# EAGLE design v2 (EAGLE 9.2.0)
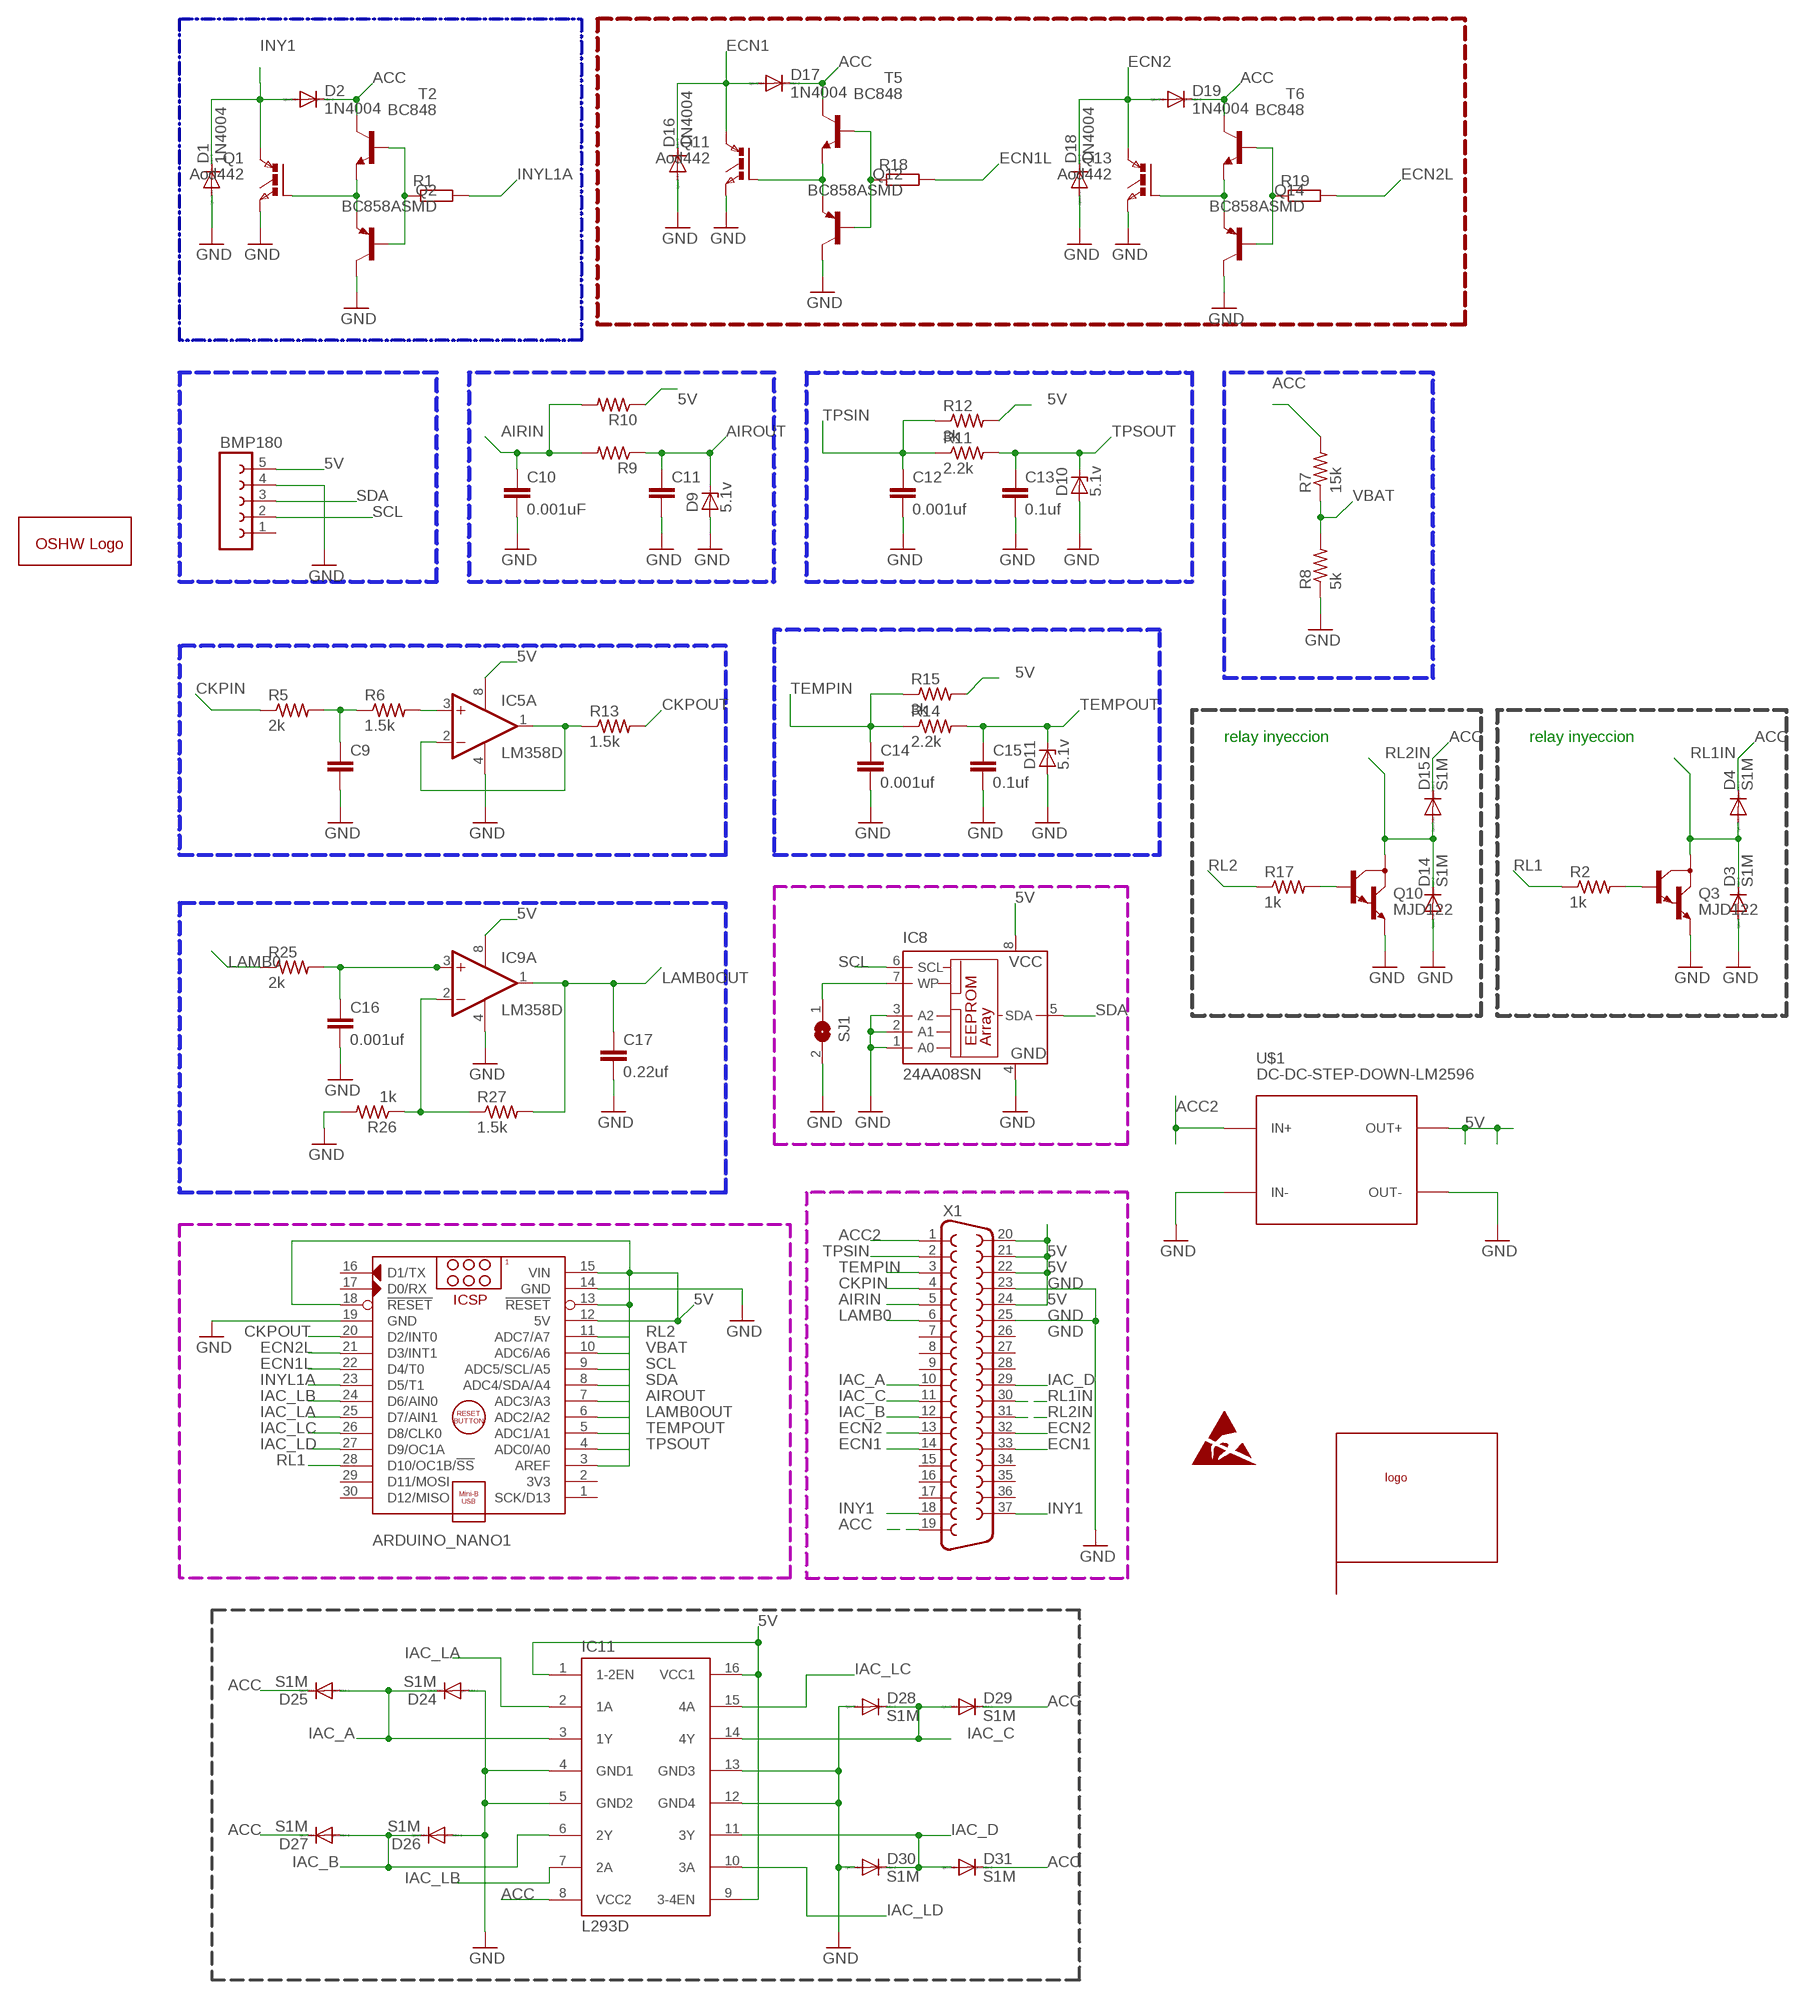
[diagram p0: schematic, sheet 1]

## Parts
ARDUINO_NANO1  ARDUINO_NANO  [ARDUINO_NANO]
BMP180  FE05-1  [FE05-1]
C9  C-EU025-025X050  [C025-025X050]
C10  0.001uF  C-EU025-025X050  [C025-025X050]
C11  C-EU025-025X050  [C025-025X050]
C12  0.001uf  C-EU025-025X050  [C025-025X050]
C13  0.1uf  C-EU025-025X050  [C025-025X050]
C14  0.001uf  C-EU025-025X050  [C025-025X050]
C15  0.1uf  C-EU025-025X050  [C025-025X050]
C16  0.001uf  C-EU025-025X050  [C025-025X050]
C17  0.22uf  C-EU025-025X050  [C025-025X050]
D1  1N4004  [DO41-10]
D2  1N4004  [DO41-10]
D3  S1M  [SMA]
D4  S1M  [SMA]
D9  5.1v  ZENER-DIODEZD-5  [ZDIO-5]
D10  5.1v  ZENER-DIODEZD-5  [ZDIO-5]
D11  5.1v  ZENER-DIODEZD-5  [ZDIO-5]
D14  S1M  [SMA]
D15  S1M  [SMA]
D16  1N4004  [DO41-10]
D17  1N4004  [DO41-10]
D18  1N4004  [DO41-10]
D19  1N4004  [DO41-10]
D24  S1M  [SMA]
D25  S1M  [SMA]
D26  S1M  [SMA]
D27  S1M  [SMA]
D28  S1M  [SMA]
D29  S1M  [SMA]
D30  S1M  [SMA]
D31  S1M  [SMA]
GOLD_ORB_SM1  OSHWLOGOLOGO8MM  [OSHW_8MM]
IC5  LM358D  [SO08]
IC8  24AA08SN  [SO-08]
IC9  LM358D  [SO08]
IC11  L293D  [DIL16]
Q1  Aod442  IGBTTO252  [TO252]
Q2  BC858ASMD  [SOT23-BEC]
Q3  MJD122  [DPAK]
Q10  MJD122  [DPAK]
Q11  Aod442  IGBTTO252  [TO252]
Q12  BC858ASMD  [SOT23-BEC]
Q13  Aod442  IGBTTO252  [TO252]
Q14  BC858ASMD  [SOT23-BEC]
R1  R-EU_0204/7  [0204/7]
R2  1k  R-US_0204/5  [0204/5]
R5  2k  R-US_0204/5  [0204/5]
R6  1.5k  R-US_0204/5  [0204/5]
R7  15k  R-US_0204/5  [0204/5]
R8  5k  R-US_0204/5  [0204/5]
R9  R-US_0204/5  [0204/5]
R10  R-US_0204/5  [0204/5]
R11  2.2k  R-US_0204/5  [0204/5]
R12  3k  R-US_0204/5  [0204/5]
R13  1.5k  R-US_0204/5  [0204/5]
R14  2.2k  R-US_0204/5  [0204/5]
R15  3k  R-US_0204/5  [0204/5]
R17  1k  R-US_0204/5  [0204/5]
R18  R-EU_0204/7  [0204/7]
R19  R-EU_0204/7  [0204/7]
R25  2k  R-US_0204/5  [0204/5]
R26  1k  R-US_0204/5  [0204/5]
R27  1.5k  R-US_0204/5  [0204/5]
SJ1  SJW  [SJW]
T2  BC848  [SOT23]
T5  BC848  [SOT23]
T6  BC848  [SOT23]
U$1  DC-DC-STEP-DOWN-LM2596  [DC-DC-STEP-DOWN-LM2596]
U$2  LOGO  [LOGO]
X1  F37HP  [F37HP]

## Nets
5V: ARDUINO_NANO1.3(AREF) ARDUINO_NANO1.12(5V) ARDUINO_NANO1.13(!RESET) ARDUINO_NANO1.15(VIN) ARDUINO_NANO1.18(!RESET) BMP180.5 IC5.8(P:V+) IC8.8(VCC) IC9.8(P:V+) IC11.1(1-2EN) IC11.9(3-4EN) IC11.16(VCC1) R10.1 R12.2 R15.2 U$1.OUT+ X1.20 X1.21 X1.22 X1.24
ACC: D2.C D4.C D15.C D17.C D19.C D25.C D27.C D29.C D31.C IC11.8(VCC2) R7.2 T2.3(C) T5.3(C) T6.3(C) X1.19
ACC2: U$1.IN+ X1.1
AIRIN: C10.1 R9.2 R10.2 X1.5
AIROUT: ARDUINO_NANO1.7(ADC3/A3) C11.1 D9.C R9.1
CKPIN: R5.1 X1.4
CKPOUT: ARDUINO_NANO1.20(D2/INT0) R13.2
CPKOUT: IC5.1(A:OUT) IC5.2(A:-IN) R13.1
ECN1: D16.C D17.A Q11.2(C) X1.14 X1.33
ECN1L: ARDUINO_NANO1.22(D4/T0) R18.2
ECN2: D18.C D19.A Q13.2(C) X1.13 X1.32
ECN2L: ARDUINO_NANO1.21(D3/INT1) R19.2
GND: ARDUINO_NANO1.14(GND) ARDUINO_NANO1.19(GND) BMP180.4 C9.2 C10.2 C11.2 C12.2 C13.2 C14.2 C15.2 C16.2 C17.2 D1.A D3.A D9.A D10.A D11.A D14.A D16.A D18.A D24.A D26.A D28.A D30.A IC5.4(P:V-) IC8.1(A0) IC8.2(A1) IC8.3(A2) IC8.4(GND) IC9.4(P:V-) IC11.4(GND1) IC11.5(GND2) IC11.12(GND4) IC11.13(GND3) Q1.3(E) Q2.C Q3.3(E) Q10.3(E) Q11.3(E) Q12.C Q13.3(E) Q14.C R8.1 R26.2 SJ1.2 U$1.IN- U$1.OUT- X1.23 X1.25
IAC_A: D24.C D25.A IC11.3(1Y) X1.10
IAC_B: D26.C D27.A IC11.6(2Y) X1.12
IAC_C: D28.C D29.A IC11.14(4Y) X1.11
IAC_D: D30.C D31.A IC11.11(3Y) X1.29
IAC_LA: ARDUINO_NANO1.25(D7/AIN1) IC11.2(1A)
IAC_LB: ARDUINO_NANO1.24(D6/AIN0) IC11.7(2A)
IAC_LC: ARDUINO_NANO1.26(D8/CLK0) IC11.15(4A)
IAC_LD: ARDUINO_NANO1.27(D9/OC1A) IC11.10(3A)
INY1: D1.C D2.A Q1.2(C) X1.18 X1.37
INYL1A: ARDUINO_NANO1.23(D5/T1) R1.2
LAMB0: R25.1 X1.6
LAMB0OUT: ARDUINO_NANO1.6(ADC2/A2) C17.1 IC9.1(A:OUT) R27.2
N$1: Q3.1(B) R2.2
N$2: Q1.1(G) Q2.E T2.2(E)
N$3: Q2.B R1.1 T2.1(B)
N$5: IC5.3(A:+IN) R6.2
N$6: C9.1 R5.2 R6.1
N$8: Q10.1(B) R17.2
N$13: Q11.1(G) Q12.E T5.2(E)
N$15: Q12.B R18.1 T5.1(B)
N$20: Q13.1(G) Q14.E T6.2(E)
N$22: Q14.B R19.1 T6.1(B)
N$31: C16.1 IC9.3(A:+IN) R25.2
N$32: IC9.2(A:-IN) R26.1 R27.1
N$34: IC8.7(WP) SJ1.1
RL1: ARDUINO_NANO1.28(D10/OC1B/!SS) R2.1
RL1IN: D3.C D4.A Q3.4(C) X1.30
RL2: ARDUINO_NANO1.11(ADC7/A7) R17.1
RL2IN: D14.C D15.A Q10.4(C) X1.31
SCL: ARDUINO_NANO1.9(ADC5/SCL/A5) BMP180.2 IC8.6(SCL)
SDA: ARDUINO_NANO1.8(ADC4/SDA/A4) BMP180.3 IC8.5(SDA)
TEMPIN: C14.1 R14.1 R15.1 X1.3
TEMPOUT: ARDUINO_NANO1.5(ADC1/A1) C15.1 D11.C R14.2
TPSIN: C12.1 R11.1 R12.1 X1.2
TPSOUT: ARDUINO_NANO1.4(ADC0/A0) C13.1 D10.C R11.2
VBAT: ARDUINO_NANO1.10(ADC6/A6) R7.1 R8.2
Unconnected: ARDUINO_NANO1.1(SCK/D13) ARDUINO_NANO1.2(3V3) ARDUINO_NANO1.16(D1/TX) ARDUINO_NANO1.17(D0/RX) ARDUINO_NANO1.29(D11/MOSI) ARDUINO_NANO1.30(D12/MISO) BMP180.1 IC5.5(B:+IN) IC5.6(B:-IN) IC5.7(B:OUT) IC9.5(B:+IN) IC9.6(B:-IN) IC9.7(B:OUT) X1.7 X1.8 X1.9 X1.15 X1.16 X1.17 X1.26 X1.27 X1.28 X1.34 X1.35 X1.36

## Buses
B$1

## Notes on the sheet
- relay inyeccion | relay inyeccion

## Library data of the parts
ARDUINO_NANO1 = ArduinoNanoV30:ARDUINO_NANO: Arduino Nano V3.0 Module Overview: The Arduino Nano is a small, complete, and breadboard-friendly board based on the ATmega328 (Arduino Nano 3.x) or ATmega168 (Arduino Nano 2.x). It has more or less the same functionality of the Arduino Duemilanove, but in a different package. It lacks only a DC power jack, and works with a Mini-B USB cable instead of a standard one. The Nano was designed and is being produced by Gravitech <http://www.gravitech.us/arna30wiatp.html>. General specifications: Item Value Microcontroller Atmel ATmega168 or ATmega328 Operating Voltage (logic level) 5 V Input Voltage (recommended) 7-12 V Input Voltage (limits) 6-20 V Digital I/O Pins 14 (of which 6 provide PWM output) Analog Input Pins 8 DC Current per I/O Pin 40 mA Flash Memory 16 KB (ATmega168) or 32 KB (ATmega328) of which 2 KB used by bootloader SRAM 1 KB (ATmega168) or 2 KB (ATmega328) EEPROM 512 bytes (ATmega168) or 1 KB (ATmega328) Clock Speed 16 MHz Dimensions (Inches) 0.73" x 1.70" Dimensions (mm) 18mm x 45mm Overall height About 9 mm (not including pins) Weigth 5 g Power: The Arduino Nano can be powered via the Mini-B USB connection, 6-20V unregulated external power supply (pin 30), or 5V regulated external power supply (pin 27). The power source is automatically selected to the highest voltage source. Memory: The ATmega168 has 16 KB of flash memory for storing code (of which 2 KB is used for the bootloader); the ATmega328 has 32 KB, (also with 2 KB used for the bootloader). The ATmega168 has 1 KB of SRAM and 512 bytes of EEPROM (which can be read and written with the EEPROM library); the ATmega328 has 2 KB of SRAM and 1 KB of EEPROM. Input and Output: Each of the 14 digital pins on the Nano can be used as an input or output, using pinMode(), digitalWrite(), and digitalRead() functions. They operate at 5 volts. Each pin can provide or receive a maximum of 40 mA and has an internal pull-up resistor (disconnected by default) of 20-50 kOhms. In addition, some pins have specialized functions. Visit Arduino - ArduinoBoardNano <https://www.arduino.cc/en/Main/ArduinoBoardNano>
BMP180 = con-lsta:FE05-1: FEMALE HEADER; OC_FARNELL: unknown; OC_NEWARK: unknown
C9-C17 = rcl:C-EU: CAPACITOR, European symbol; SPICEPREFIX: C
D1 D2 D16-D19 = diode:1N4004: DIODE general purpose rectifier, 1 A
D3 D4 D14 D15 D24-D31 = diode:S1M
D9-D11 = diode:ZENER-DIODE: Z-Diode
GOLD_ORB_SM1 = oshw:OSHWLOGO: The OSHW logo for PCB layout
IC5 IC9 = linear:LM358: OP AMP also LM158; LM258; LM2904 Source: http://cache.national.com/ds/LM/LM158.pdf
IC8 = microchip:24*: Serial EEPROM I2C; MF: MICROCHIP; MPN: 24AA08-I/SN; OC_FARNELL: 1579568; OC_NEWARK: 92C6826
IC11 = st-microelectronics:L293D: PUSH-PULL 4 CHANNEL DRIVER
Q1 Q11 Q13 = IGBT:IGBT: IGBT
Q2 Q12 Q14 = transistor-pnp:BC858*: PNP Transistror
Q3 Q10 = MJD122:MJD122: TRANS DARL NPN 100V 5A DPAK; AVAILABILITY: Unavailable; MF: STMicroelectronics; MP: MJD122; PACKAGE: None; PRICE: None
R1 R18 R19 = rcl:R-EU_: RESISTOR, European symbol; SPICEPREFIX: R
R2 R5-R15 R17 R25-R27 = rcl:R-US_: RESISTOR, American symbol; SPICEPREFIX: R
SJ1 = jumper:SJ: SMD solder JUMPER
T2 T5 T6 = transistor:BC848: NPN TRANSISTOR
U$1 = diy-modules:DC-DC-STEP-DOWN-LM2596: DC/DC Step-Down Regulator based on LM2596-ADJ chip LM2596 datasheet available here: http://www.ti.com/lit/ds/symlink/lm2596.pdf Click here to find device on ebay.com <http://www.ebay.com/sch/lm2596+power+regulator>
U$2 = ArduinoNanoV30:LOGO
X1 = con-subd:F37: SUB-D; OC_FARNELL: unknown; OC_NEWARK: unknown

## Board
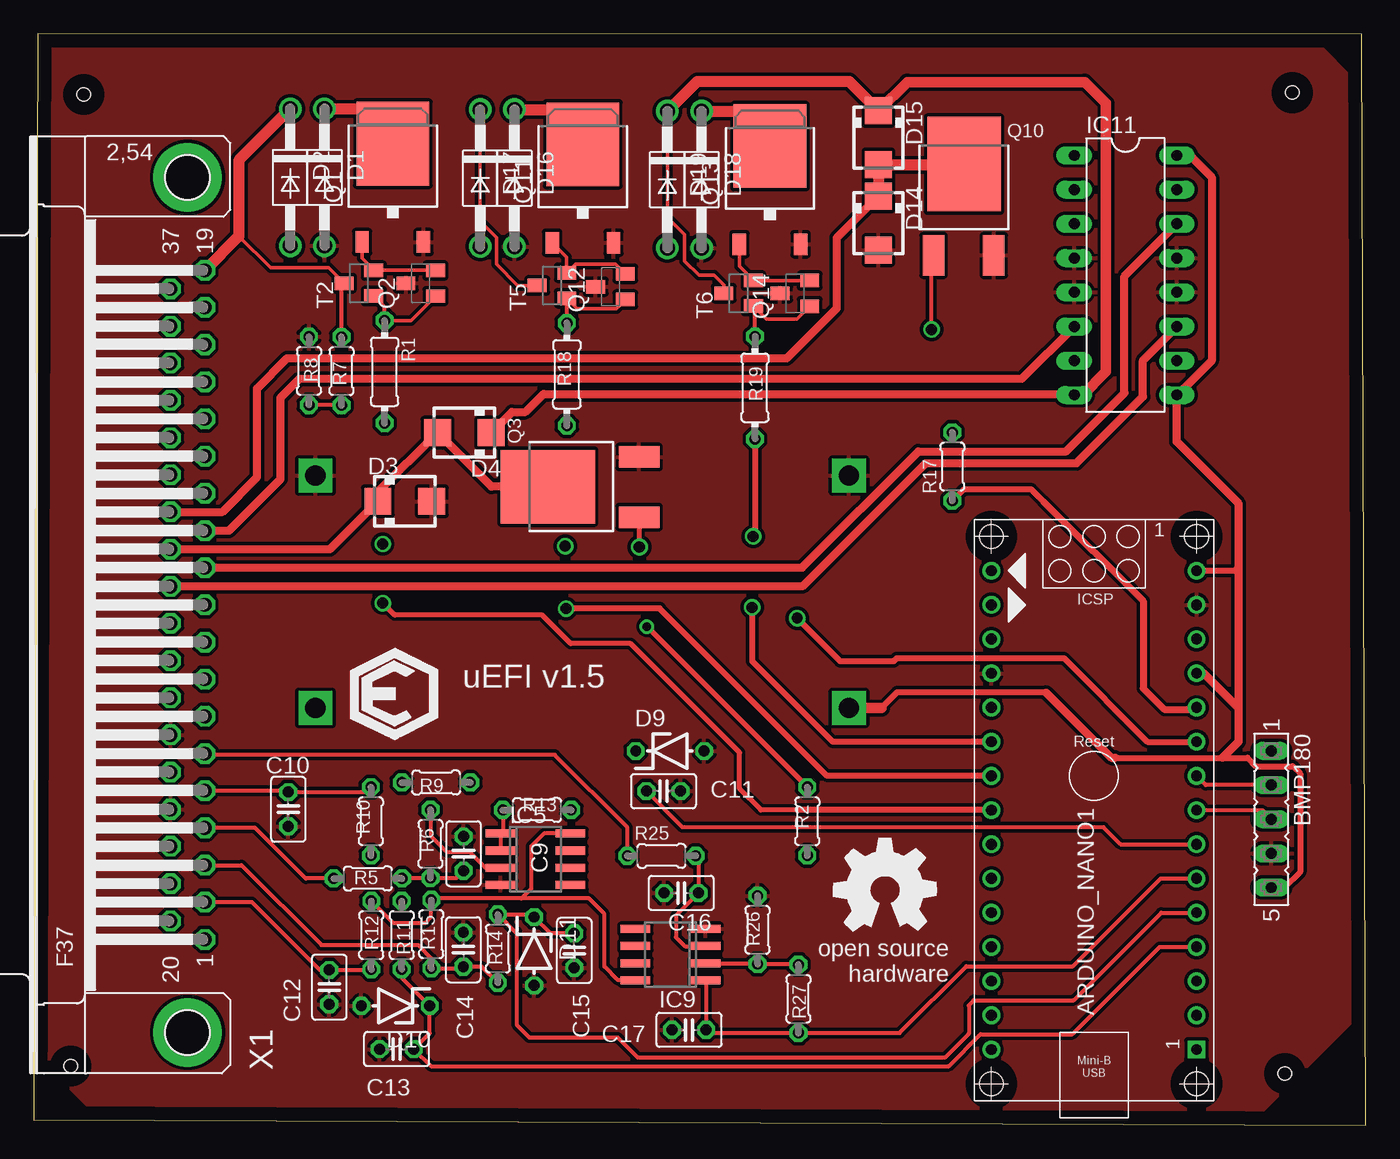
[diagram p1: board, top side]
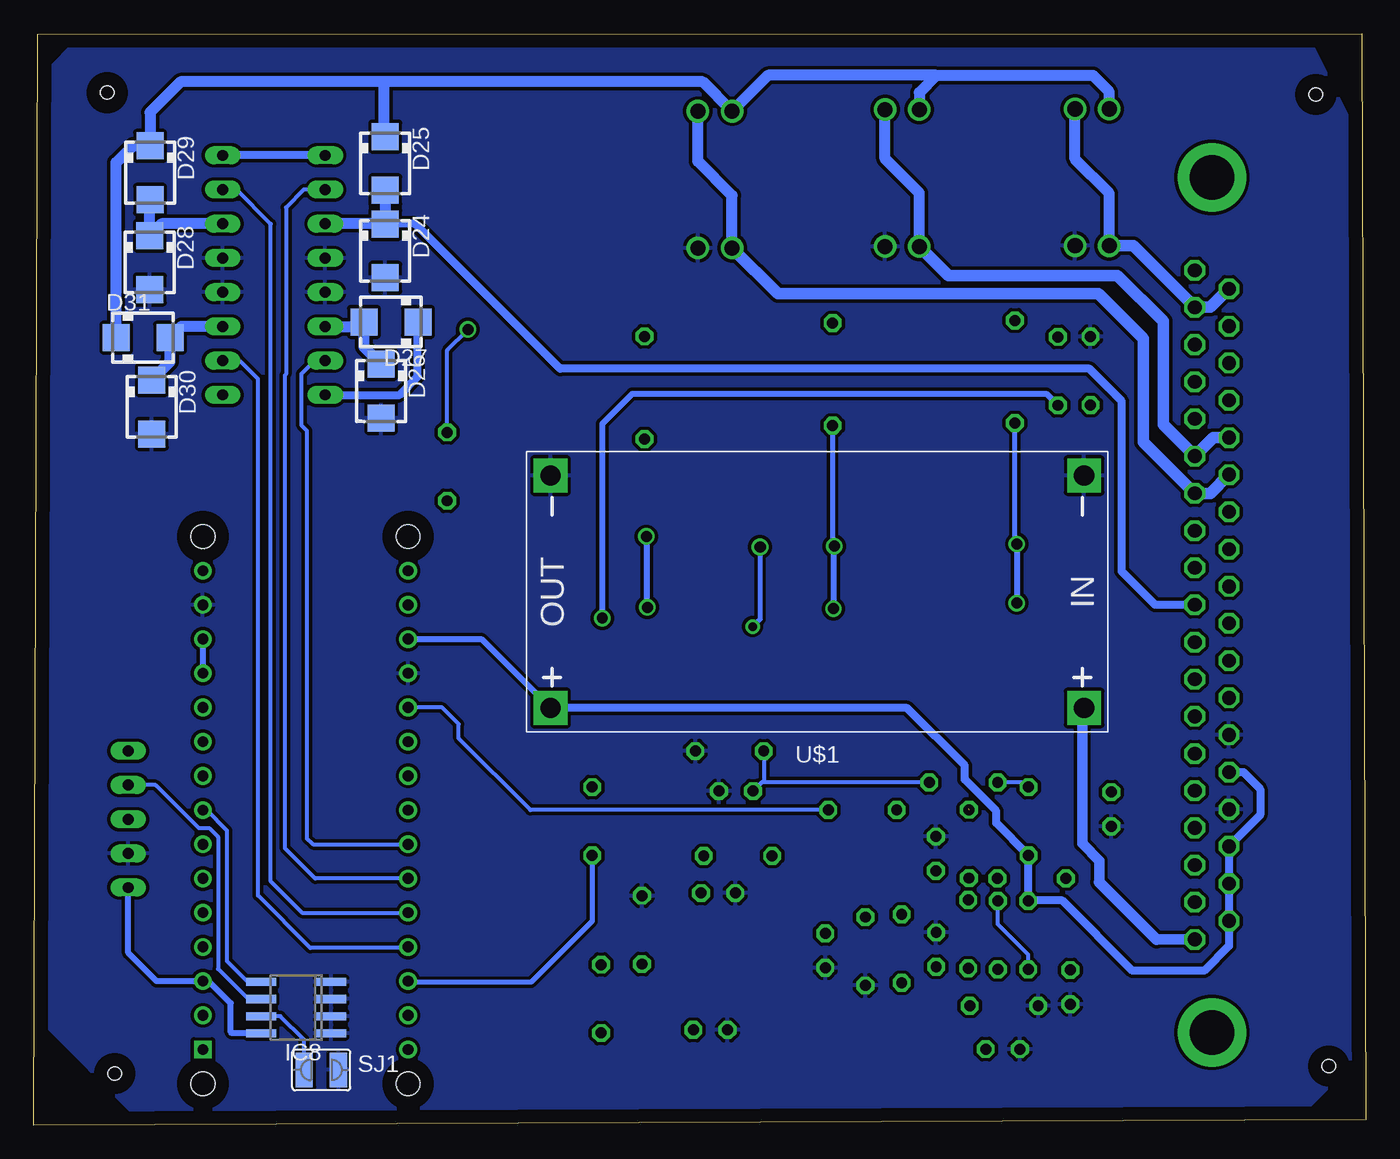
[diagram p2: board, bottom side, seen from below]

Size 98.93 x 81.05 mm. Coordinates in mm from the lower left corner, seen from the top.
Outline: 0,0.4 98.92,0 98.62,81.02 0.3,81.05 0,0.4
Copper layers (1*16): Top 0.035mm / dielectric 1.5mm / Bottom 0.035mm
Design rules "default *": minimum track width 6mil, minimum drill 0.35mm, track to track 10mil, track to pad 10mil, pad to pad 10mil, via to via 10mil, smd to smd 10mil, copper to edge 40mil, drill to drill 6mil, minimum pad ring 10mil, minimum via ring 8mil, stop-mask expansion 4mil, vias tented up to drill 0mil, thermal gap 10mil
Holes 1 mm at 3.72,76.54 93.46,76.68 92.91,3.83 2.76,4.38

### Footprints (pad centres in the part's own frame; a part is rotated, then mirrored left to right if it is on the bottom)
ARDUINO_NANO = drill 0.8 square: 1 -20.32,-7.62 | drill 0.8: 2 -17.78,-7.62; 3 -15.24,-7.62; 4 -12.7,-7.62; 5 -10.16,-7.62; 6 -7.62,-7.62; 7 -5.08,-7.62; 8 -2.54,-7.62; 9 0,-7.62; 10 2.54,-7.62; 11 5.08,-7.62; 12 7.62,-7.62; 13 10.16,-7.62; 14 12.7,-7.62; 15 15.24,-7.62; 16 15.24,7.62; 17 12.7,7.62; 18 10.16,7.62; 19 7.62,7.62; 20 5.08,7.62; 21 2.54,7.62; 22 0,7.62; 23 -2.54,7.62; 24 -5.08,7.62; 25 -7.62,7.62; 26 -10.16,7.62; 27 -12.7,7.62; 28 -15.24,7.62; 29 -17.78,7.62; 30 -20.32,7.62 | hole 1.778: -22.86,-7.62; -22.86,7.62; 17.78,7.62; 17.78,-7.62
FE05-1 = drill 0.813 long: 1 -5.08,0; 2 -2.54,0; 3 0,0; 4 2.54,0; 5 5.08,0
C025-025X050 = drill 0.813 octagon: 1 -1.27,0; 2 1.27,0
DO41-10 = drill 1.118: A 5.08,0; C -5.08,0
SMA = smd 2 x 2: A 2,0; C -2,0
ZDIO-5 = drill 0.813 octagon: A 2.54,0; C -2.54,0
SO08 = smd 0.6 x 2.2: 1 -1.905,-2.6; 2 -0.635,-2.6; 3 0.635,-2.6; 4 1.905,-2.6; 5 1.905,2.6; 6 0.635,2.6; 7 -0.635,2.6; 8 -1.905,2.6
SO-08 = smd 0.6 x 2.2: 1 -1.905,-2.6; 2 -0.635,-2.6; 3 0.635,-2.6; 4 1.905,-2.6; 5 1.905,2.6; 6 0.635,2.6; 7 -0.635,2.6; 8 -1.905,2.6
DIL16 = drill 0.813 long: 1 -8.89,-3.81; 2 -6.35,-3.81; 3 -3.81,-3.81; 4 -1.27,-3.81; 5 1.27,-3.81; 6 3.81,-3.81; 7 6.35,-3.81; 8 8.89,-3.81; 9 8.89,3.81; 10 6.35,3.81; 11 3.81,3.81; 12 1.27,3.81; 13 -1.27,3.81; 14 -3.81,3.81; 15 -6.35,3.81; 16 -8.89,3.81
TO252 = smd 1 x 1.6: 1 -2.28,-4.8; 3 2.28,-4.8 | smd 5.4 x 6.2: 2 0,2.5
SOT23-BEC = smd 1 x 1.4: B -0.95,-1.1; C 0,1.1; E 0.95,-1.1
DPAK = smd 1.6 x 2.997: 1 -2.261,-4.928; 3 2.21,-4.928 | smd 5.452 x 7: 4 0,1.853
0204/7 = drill 0.813 octagon: 1 -3.81,0; 2 3.81,0
0204/5 = drill 0.813 octagon: 1 -2.54,0; 2 2.54,0
SJW = smd 1.27 x 2.54: 1 -1.27,0; 2 1.27,0
SOT23 = smd 1 x 1.4: 1 -0.95,-1.1; 2 0.95,-1.1; 3 0,1.1
DC-DC-STEP-DOWN-LM2596 = drill 1.5 pad 2.5 square: IN+ -19.812,8.636; IN- -19.812,-8.636; OUT+ 19.812,8.636; OUT- 19.812,-8.636
F37HP = drill 1.016 octagon: 1 -24.841,-1.27; 2 -22.073,-1.27; 3 -19.329,-1.27; 4 -16.561,-1.27; 5 -13.792,-1.27; 6 -11.049,-1.27; 7 -8.28,-1.27; 8 -5.512,-1.27; 9 -2.769,-1.27; 10 0,-1.27; 11 2.769,-1.27; 12 5.512,-1.27; 13 8.28,-1.27; 14 11.049,-1.27; 15 13.818,-1.27; 16 16.561,-1.27; 17 19.329,-1.27; 18 22.098,-1.27; 19 24.841,-1.27; 20 -23.47,1.27; 21 -20.701,1.27; 22 -17.932,1.27; 23 -15.189,1.27; 24 -12.421,1.27; 25 -9.652,1.27; 26 -6.909,1.27; 27 -4.14,1.27; 28 -1.372,1.27; 29 1.372,1.27; 30 4.14,1.27; 31 6.909,1.27; 32 9.677,1.27; 33 12.421,1.27; 34 15.189,1.27; 35 17.958,1.27; 36 20.701,1.27; 37 23.47,1.27 | drill 3.302 pad 5.08: G1 -31.75,0; G2 31.75,0

### Placement (x,y rotation side)
ARDUINO_NANO1  78.74,25.93 90 top
BMP180  91.9,22.71 270 top
C9  31.93,20.15 90 top
C10  18.91,23.46 270 top
C11  46.77,24.8 0 top
C12  21.95,10.24 270 top
C13  26.96,5.64 180 top
C14  31.91,13.03 90 top
C15  40.14,12.96 270 top
C16  48.09,17.23 180 top
C17  48.67,7.07 180 top
D1  21.59,70.38 270 top
D2  19.05,70.38 270 top
D3  27.56,46.33 0 top
D4  31.98,51.43 180 top
D9  47.25,27.77 0 top
D10  26.87,8.85 180 top
D11  37.17,12.9 270 top
D14  62.73,66.98 270 top
D15  62.73,73.33 270 top
D16  35.7,70.33 270 top
D17  33.16,70.33 270 top
D18  49.6,70.21 270 top
D19  47.06,70.21 270 top
D24  72.82,64.92 270 bottom
D25  72.82,71.41 270 bottom
D26  73.13,54.51 270 bottom
D27  72.39,59.65 180 bottom
D28  90.31,64.05 270 bottom
D29  90.28,70.73 270 bottom
D30  90.16,53.33 270 bottom
D31  90.8,58.48 0 bottom
GOLD_ORB_SM1  63.19,17.45 0 top
IC5  37.26,19.75 270 top
IC8  79.43,8.72 90 bottom
IC9  47.29,12.66 90 top
IC11  81.08,63.12 270 top
Q1  26.67,70.38 0 top
Q2  28.74,62.51 90 top
Q3  40.03,47.41 90 top
Q10  69.08,69.52 0 top
Q11  40.78,70.33 0 top
Q12  42.84,62.26 90 top
Q13  54.68,70.21 0 top
Q14  56.53,61.77 90 top
R1  26.06,55.94 270 top
R2  57.45,22.56 90 top
R5  24.82,18.32 0 top
R6  29.47,20.88 90 top
R7  22.86,55.99 90 top
R8  20.44,56.01 270 top
R9  29.88,25.44 180 top
R10  25.04,22.56 90 top
R11  27.33,14.11 270 top
R12  25.07,14.1 90 top
R13  37.38,23.4 0 top
R14  34.47,13.11 90 top
R15  29.53,14.18 90 top
R17  68.22,48.9 90 top
R18  39.59,55.75 270 top
R19  53.57,54.76 270 top
R25  46.63,19.99 0 top
R26  53.76,14.5 90 top
R27  56.78,9.38 270 top
SJ1  77.57,4.09 0 bottom
T2  24.15,62.52 90 top
T5  38.49,62.35 90 top
T6  52.35,61.77 90 top
U$1  40.73,39.61 180 bottom
U$2  27.01,31.9 0 top
X1  11.43,38.63 90 top

### Tracks (layer width: path | path; a pad name or v marks a point on that pad's centre or on a via)
5V
  Top 0.305: R12.2 26.68,15.03 29.09,15.03 29.51,15.45 29.51,16.7 R15.2 29.63,16.83 36.22,16.83 | IC5.8 37.89,21.65 36.94,20.7 36.94,17.55 36.22,16.83 | IC9.8 43.41,10.76 42.38,11.78 42.38,15.68 41.23,16.83 36.22,16.83
  Top 0.457: 75.17,32.12 75.15,32.15 64.14,32.15 62.96,30.97 | BMP180.5 92.75,17.63 92.81,17.58 94.04,18.8 94.04,26.11 93.5,26.65 90.76,26.65 90.15,27.27 88.28,27.27 80.31,27.27 | ARDUINO_NANO1.15 89.19,41.17 89.49,41.47
  Top 0.61: 80.31,27.27 80.03,27.27 75.17,32.12 | 88.28,27.27 89.49,28.48 89.49,30.94 | 89.49,30.94 86.88,33.55 ARDUINO_NANO1.12 | 89.49,30.94 89.49,41.47 89.49,46.15 84.89,50.76 84.89,54.16 | 84.89,54.16 IC11.9 | IC11.16 85.86,72.01 87.49,70.38 87.49,56.76 84.89,54.16
  Top 0.762: U$1.OUT+ 62.96,30.97
  Bottom 0.305: 25.04,16.67 R12.2
  Bottom 0.457: ARDUINO_NANO1.18 65.67,36.09 U$1.OUT+ | ARDUINO_NANO1.13 ARDUINO_NANO1.12 | IC8.8 84.22,6.82 84.3,6.9 84.3,9.06 85.93,10.69 ARDUINO_NANO1.3 89.81,10.69 91.9,12.78 BMP180.5
  Bottom 0.61: 25.04,16.67 22.54,16.67 17.34,11.47 12,11.47 10.16,13.31 X1.20 X1.21 X1.22 7.84,23.02 7.84,24.96 9.09,26.21 X1.24 | R12.2 25.07,19.99 R10.1 27.45,22.42 27.45,23.33 29.79,25.67 29.79,26.69 34.06,30.97 U$1.OUT+ | IC11.1 IC11.16
ACC
  Top 0.254: T2.3 21.91,63.66 17.59,63.66 15.24,66.01 | D17.C 33.16,67.12 34.38,65.9 34.38,63.92 35.95,62.35 T5.3 | D19.C 47.06,67.39 48.34,66.11 48.34,64.16 49.4,63.1 50.52,63.1 51.25,62.38 T6.3
  Top 0.305: R7.2 22.86,62.32 T2.3
  Top 0.356: 77.86,54.19
  Top 0.61: D4.C 35.51,52.96 36.52,52.96 37.87,54.3 77.2,54.3 77.31,54.19
  Top 0.762: D15.C 64.87,77.46 78.05,77.46 79.62,75.89 79.62,55.95 77.86,54.19 77.31,54.19 IC11.8
  Top 0.813: X1.19 15.24,66.01 15.24,71.65 D2.C | D15.C 60.57,77.5 49.26,77.5 D19.C
  Bottom 0.61: IC11.8 71.77,54.23 70.4,55.6 70.4,59.64 D27.C
  Bottom 0.813: D2.C 19.05,76.73 20.27,77.95 31.89,77.95 | 31.89,77.95 33.16,76.68 D17.C | 31.89,77.95 44.4,77.95 D19.C 49.23,77.47 72.91,77.47 | 72.91,77.47 88.02,77.47 90.28,75.21 D29.C 91.55,72.73 92.8,71.48 D31.C | D25.C 72.91,73.5 72.91,77.47
ACC2
  Bottom 0.762: U$1.IN+ 21.06,30.83 21.06,20.91 19.79,19.64 19.79,18.03 | X1.1 15.54,13.79
  Bottom 0.813: 15.54,13.79 19.79,18.03
AIRIN
  Top 0.305: X1.5 18.8,24.84 C10.1 24.67,24.73 R10.2
  Bottom 0.305: R10.2 25.38,25.44 R9.2
AIROUT
  Top 0.305: ARDUINO_NANO1.7 80.71,20.85 79.44,22.12 48.18,22.12 C11.1
  Bottom 0.305: R9.1 44.87,25.44 C11.1 44.71,25.59 D9.C
CKPIN
  Top 0.305: R5.1 20.2,18.32 16.45,22.07 X1.4
CKPOUT
  Bottom 0.305: 71.16,30.97 ARDUINO_NANO1.20 68.59,31.01 67.36,29.78 67.36,28.72 62.03,23.4 R13.2
CPKOUT
  Top 0.305: IC5.2 IC5.1 34.84,21.83 R13.1
ECN1
  Top 0.813: D16.C 40.23,75.41 41.06,74.57 40.8,74.31 40.8,72.17 40.75,72.12 40.54,72.12 40.54,72.59 Q11.2
  Bottom 0.813: D17.A 33.16,69.22 35.7,71.76 D16.C
  Bottom 0.864: X1.33 11.33,51.05 X1.14 15.05,52.03 15.05,59.69 18.43,63.07 30.98,63.07 D17.A
ECN1L  (via drill 0.81)
  Top 0.457: ARDUINO_NANO1.22 58.92,25.93 46.49,38.37 39.55,38.37 v39.53,38.35
  Bottom 0.356: R18.2 39.59,42.97 39.55,42.92
  Bottom 0.457: v39.53,38.35 39.55,38.36 39.55,42.92 v39.47,42.99
ECN2
  Top 0.813: D18.C 54.48,75.29 54.73,75.04 54.73,72.77 Q13.2
  Bottom 0.813: D19.A 47.06,69.03 49.6,71.57 D18.C
  Bottom 0.864: X1.32 11.56,46.91 X1.13 16.52,50.73 16.52,58.39 19.87,61.74 43.66,61.74 D19.A
ECN2L  (via drill 0.81)
  Top 0.457: R19.2 53.57,43.85 v53.43,43.71 | v53.35,38.45 53.35,34.45 59.33,28.47 ARDUINO_NANO1.21
  Bottom 0.457: v53.43,43.71 53.43,38.53 v53.35,38.45
GND
  pour Top: 0.37,74.08 0.37,78.97 2.31,80.92 94.7,80.92 98.56,77.06 98.56,8.38 90.54,0.36 5.13,0.36 0.41,5.07 0.41,73.51 0.02,73.9
  pour Bottom: 4.45,81.04 95.16,81.04 98.45,77.75 98.45,7.85 91.15,0.55 5.07,0.55 0.69,4.94 0.69,73.51
IAC_A
  Bottom 0.508: D24.C 72.83,66.93
  Bottom 0.61: X1.10 15.64,38.63 18.13,41.13 18.13,53.77 20.53,56.17 59.84,56.17 70.6,66.93 73.35,66.93
  Bottom 0.813: D25.A D24.C | 72.83,66.93 73.35,66.93 IC11.3
IAC_B
  Top 0.61: IC11.6 73.38,55.42 19.75,55.42 18.32,53.99 18.32,47.95 14.51,44.14 X1.12
  Bottom 0.813: D26.C 74.39,57.78 D27.A 74.73,59.31 IC11.6
IAC_C
  Top 0.61: IC11.14 81,63.04 81,54.37 76.66,50.03 65.69,50.03 57.06,41.4 X1.11
  Bottom 0.813: IC11.14 89.43,66.93 D28.C 90.31,68.7 D29.A
IAC_D
  Top 0.61: IC11.11 82.37,56.79 82.37,54.09 77.44,49.16 66.25,49.16 57.09,40 X1.29
  Bottom 0.813: IC11.11 87.97,59.31 D31.A 88.8,56.69 D30.C
IAC_LA
  Bottom 0.305: IC11.2 78.86,69.47 80.19,68.14 80.19,55.77 80.28,55.67 80.28,20.59 78.01,18.31 ARDUINO_NANO1.25
IAC_LB
  Bottom 0.305: IC11.7 78.07,56.77 79.06,55.78 79.06,51.99 78.64,51.57 78.64,21.3 78.19,20.85 ARDUINO_NANO1.24
IAC_LC
  Bottom 0.305: ARDUINO_NANO1.26 79,15.77 81.31,18.09 81.31,66.92 83.89,69.5 83.92,69.47 IC11.15
IAC_LD
  Bottom 0.305: IC11.10 83.64,56.77 82.26,55.4 82.26,17.04 78.38,13.16 71.19,13.16 ARDUINO_NANO1.27
INY1
  Top 0.813: D1.C 26.35,75.46 26.67,75.14 Q1.2
  Bottom 0.813: D2.A 19.05,69.2 21.59,71.74 D1.C
  Bottom 0.864: D2.A 17.27,65.3 X1.18 11.53,60.73 X1.37
INYL1A  (via drill 0.81)
  Top 0.356: 56.76,23.39 54,23.39 52.42,24.97 52.42,27.66 44.33,35.75 39.88,35.75 37.76,37.87 26.82,37.87 v25.92,38.77
  Top 0.457: 26.06,43.29 v25.92,43.15 | ARDUINO_NANO1.23 56.76,23.39
  Bottom 0.356: v25.92,43.15 26.06,43.29 R1.2
  Bottom 0.457: v25.92,43.15 v25.92,38.77
LAMB0
  Top 0.305: R25.1 44.09,22.1 38.69,27.5 12.78,27.5 X1.6
LAMB0OUT
  Top 0.305: IC9.1 49.94,10.7 C17.1 50.17,6.84 R27.2 64.3,6.84 69.25,11.79 77.18,11.79 83.7,18.31 ARDUINO_NANO1.6
N$1  (via drill 0.65, 0.85)
  Top 0.356: R2.2 v45.53,37.02 | 44.99,45.12 Q3.1 44.96,42.95 v44.99,42.93
  Bottom 0.356: v44.99,42.93 44.99,37.56 v45.53,37.02
N$2
  Top 0.254: Q2.E 29.82,63.49 25.29,63.49 | Q1.1 24.39,64.37 25.27,63.49
  Top 0.305: 25.29,63.49 25.27,63.49 T2.2
N$3
  Top 0.254: Q2.B 28.03,59.75 R1.1
  Top 0.305: R1.1 26.06,60.76 T2.1
N$5  (1 unrouted)
  Top 0.305: IC5.3 33.56,19.11 32.4,20.27 30.69,20.27 29.51,21.45 29.51,23.46
N$6
  Top 0.305: R5.2 27.38,18.34 R6.1 31.38,18.34 C9.1
N$8  (via drill 0.81)
  Top 0.305: v66.68,59.09 66.68,64.45 Q10.1
  Bottom 0.305: R17.2 68.22,57.55 v66.68,59.09
N$13
  Top 0.254: Q11.1 39.59,64.44 T5.2 40.23,63.94 43.21,63.94 Q12.E
N$15
  Top 0.254: Q12.B 43.27,60.64 40.34,60.64 T5.1
  Top 0.305: R18.1 T5.1
N$20
  Top 0.254: Q14.E T6.2 52.4,63.77 Q13.1
N$22
  Top 0.254: T6.1 54.42,59.85 56.67,59.85 Q14.B
  Top 0.305: R19.1 53.57,60.7 T6.1
N$31
  Top 0.305: IC9.3 49.87,13.28 48.36,13.28 47.7,13.94 47.7,15.57 C16.1 49.36,19.8 R25.2
N$32
  Top 0.305: R27.1 56.74,11.96 R26.1 49.95,11.96 IC9.2
N$34
  Bottom 0.305: SJ1.1 78.84,6.32 80.61,8.09 IC8.7
RL1
  Bottom 0.356: R2.1 57.45,15.15 61.98,10.61 71.04,10.61 ARDUINO_NANO1.28
RL1IN
  Top 0.61: X1.30 22.01,42.77 D3.C 25.56,47 D4.A 34,47.41 Q3.4
RL2
  Top 0.457: R17.1 69.09,47.23 74.07,47.23 75.01,46.29
  Top 0.508: ARDUINO_NANO1.11 86.23,30.88 83.95,30.88 82.39,32.44 82.39,38.91 75.01,46.29
RL2IN
  Top 0.61: D14.C 59.65,65.89 59.65,60.66 55.93,56.95 18.82,56.95 16.59,54.71 16.59,48.11 14.02,45.54 X1.31
  Top 0.813: D14.C D15.A 69.04,71.33 Q10.4
SCL
  Top 0.305: BMP180.2 87.04,25.25 ARDUINO_NANO1.9
  Bottom 0.305: IC8.6 83,9.36 85.24,11.6 85.24,21.39 85.9,22.05 86.67,22.05 89.87,25.25 BMP180.2
SDA
  Top 0.305: ARDUINO_NANO1.8 91.22,23.39 BMP180.3
  Bottom 0.305: ARDUINO_NANO1.8 86.09,23.39 84.58,21.88 84.58,12.18 83.03,10.63 IC8.5
TEMPIN
  Top 0.305: X1.3 15.44,19.3 21.37,13.37 28.55,13.37 29.57,12.35 29.57,11.68 R15.1 31.79,11.64 C14.1 33.28,11.76 R14.1
TEMPOUT
  Top 0.305: C15.1 38.38,14.23 D11.C 36.96,15.65 R14.2 35.87,14.25 | 35.87,14.25 35.87,7.45 36.82,6.5 43.38,6.5 44.88,5 67.66,5 69.43,6.78 69.43,8.89 69.81,9.27 77.23,9.27 83.73,15.77 ARDUINO_NANO1.5 | 35.87,14.25 35.87,14.37 35.88,14.39
TPSIN
  Top 0.305: X1.2 16.2,16.56 21.25,11.51 C12.1 | C12.1 22,11.56 | C12.1 25.02,11.51 R12.1
  Bottom 0.305: R12.1 25.07,12.65 27.33,14.91 R11.1
TPSOUT
  Top 0.305: R11.2 27.33,10.94 D10.C 29.41,6.82 C13.1 29.5,4.37 67.95,4.37 70.32,6.74 77.13,6.74 83.62,13.23 ARDUINO_NANO1.4
VBAT  (via drill 0.81)
  Top 0.305: R7.1 20.46,53.45 R8.2
  Top 0.457: ARDUINO_NANO1.10 82.7,28.47 76.48,34.69 64.1,34.69 63.87,34.46 59.89,34.46 v56.7,37.65
  Bottom 0.457: v56.7,37.65 56.7,52.09 54.47,54.32 23.73,54.32 R7.1

### Text on the board
tNames: uEFI v1.5